# EAGLE design smartStarter (EAGLE 9.3.0)
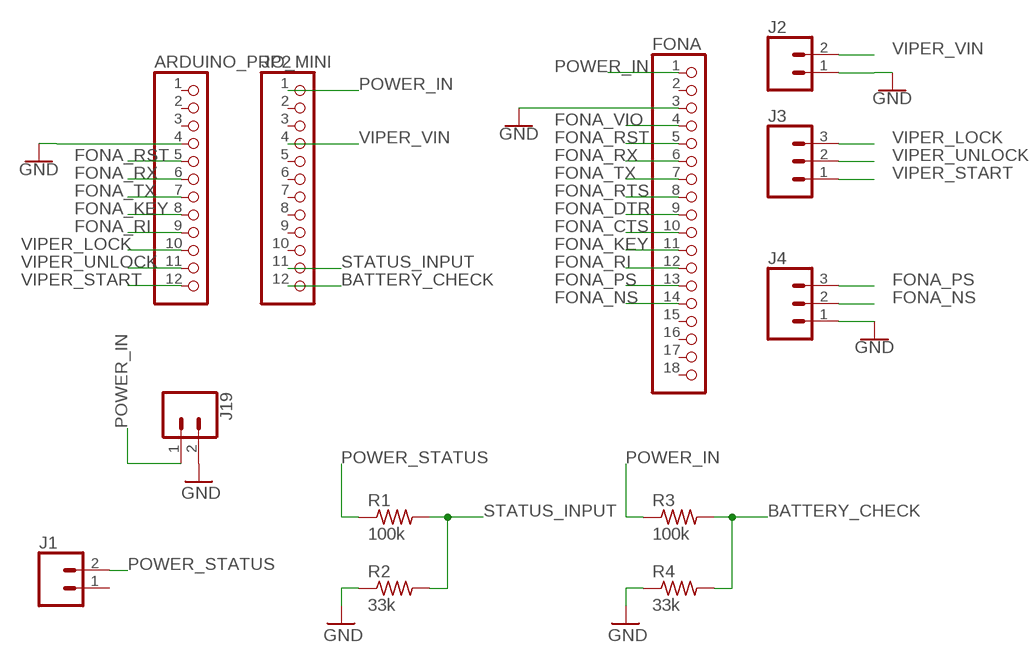
[diagram p0: schematic, sheet 1]

## Parts
ARDUINO_PRO_MINI  PINHD-1X12  [1X12]
FONA  PINHD-1X18  [1X18]
J1  CONN_023.5MM  [SCREWTERMINAL-3.5MM-2]
J2  CONN_023.5MM  [SCREWTERMINAL-3.5MM-2]
J3  CONN_03SCREW  [SCREWTERMINAL-3.5MM-3]
J4  CONN_03SCREW  [SCREWTERMINAL-3.5MM-3]
J19  CONN_023.5MM  [SCREWTERMINAL-3.5MM-2]
JP2  PINHD-1X12  [1X12]
R1  100k  R-US_0204/7  [0204/7]
R2  33k  R-US_0204/7  [0204/7]
R3  100k  R-US_0204/7  [0204/7]
R4  33k  R-US_0204/7  [0204/7]

## Nets
BATTERY_CHECK: JP2.12 R3.2 R4.2
FONA_CTS: FONA.10
FONA_DTR: FONA.9
FONA_KEY: ARDUINO_PRO_MINI.8 FONA.11
FONA_NS: FONA.14 J4.2
FONA_PS: FONA.13 J4.3
FONA_RI: ARDUINO_PRO_MINI.9 FONA.12
FONA_RST: ARDUINO_PRO_MINI.5 FONA.5
FONA_RTS: FONA.8
FONA_RX: ARDUINO_PRO_MINI.6 FONA.6
FONA_TX: ARDUINO_PRO_MINI.7 FONA.7
FONA_VIO: FONA.4
GND: ARDUINO_PRO_MINI.4 FONA.3 J2.1 J4.1 J19.2 R2.1 R4.1
POWER_IN: FONA.1 J19.1 JP2.1 R3.1
POWER_STATUS: J1.2 R1.1
STATUS_INPUT: JP2.11 R1.2 R2.2
VIPER_LOCK: ARDUINO_PRO_MINI.10 J3.3
VIPER_START: ARDUINO_PRO_MINI.12 J3.1
VIPER_UNLOCK: ARDUINO_PRO_MINI.11 J3.2
VIPER_VIN: J2.2 JP2.4
Unconnected: ARDUINO_PRO_MINI.1 ARDUINO_PRO_MINI.2 ARDUINO_PRO_MINI.3 FONA.2 FONA.15 FONA.16 FONA.17 FONA.18 J1.1 JP2.2 JP2.3 JP2.5 JP2.6 JP2.7 JP2.8 JP2.9 JP2.10

## Library data of the parts
ARDUINO_PRO_MINI JP2 = adafruit:PINHD-1X12: PIN HEADER
FONA = adafruit:PINHD-1X18: PIN HEADER
J1 J2 J19 = SparkFun-Connectors:CONN_02: Multi connection point. Often used as Generic Header-pin footprint for 0.1 inch spaced/style header connections On any of the 0.1 inch spaced packages, you can populate with these: Break Away Headers - Straight <https://www.sparkfun.com/products/116> (PRT-00116) Break Away Male Headers - Right Angle <https://www.sparkfun.com/products/553> (PRT-00553) Female Headers <https://www.sparkfun.com/products/115> (PRT-00115) Break Away Headers - Machine Pin <https://www.sparkfun.com/products/117> (PRT-00117) Break Away Female Headers - Swiss Machine Pin <https://www.sparkfun.com/products/743> (PRT-00743) For SCREWTERMINALS and SPRING TERMINALS visit here: Screw Terimnals on SparkFun.com <https://www.sparkfun.com/search/results?term=Screw+Terminals> (5mm/3.5mm/2.54mm spacing) This device is also useful as a general connection point to wire up your design to another part of your project. Our various solder wires solder well into these plated through hole pads. Hook-Up Wire - Assortment (Stranded, 22 AWG) <https://www.sparkfun.com/products/11375> (PRT-11375) Hook-Up Wire - Assortment (Solid Core, 22 AWG) <https://www.sparkfun.com/products/11367> (PRT-11367) View the entire wire category on our website here <https://www.sparkfun.com/categories/141> Special notes: Molex polarized connector foot print use with: PRT-08233 with associated crimp pins and housings. 2.54_SCREWTERM for use with PRT-10571. 3.5mm Screw Terminal footprints for PRT-08084 5mm Screw Terminal footprints for use with PRT-08432; PROD_ID: CONN-08399
J3 J4 = SparkFun-Connectors:CONN_03: Multi connection point. Often used as Generic Header-pin footprint for 0.1 inch spaced/style header connections On any of the 0.1 inch spaced packages, you can populate with these: Break Away Headers - Straight <https://www.sparkfun.com/products/116> (PRT-00116) Break Away Male Headers - Right Angle <https://www.sparkfun.com/products/553> (PRT-00553) Female Headers <https://www.sparkfun.com/products/115> (PRT-00115) Break Away Headers - Machine Pin <https://www.sparkfun.com/products/117> (PRT-00117) Break Away Female Headers - Swiss Machine Pin <https://www.sparkfun.com/products/743> (PRT-00743) Stackable Header - 3 Pin (Female, 0.1") <https://www.sparkfun.com/products/13875> (PRT-13875) For SCREWTERMINALS and SPRING TERMINALS visit here: Screw Terimnals on SparkFun.com <https://www.sparkfun.com/search/results?term=Screw+Terminals> (5mm/3.5mm/2.54mm spacing) This device is also useful as a general connection point to wire up your design to another part of your project. Our various solder wires solder well into these plated through hole pads. Hook-Up Wire - Assortment (Stranded, 22 AWG) <https://www.sparkfun.com/products/11375> (PRT-11375) Hook-Up Wire - Assortment (Solid Core, 22 AWG) <https://www.sparkfun.com/products/11367> (PRT-11367) View the entire wire category on our website here <https://www.sparkfun.com/categories/141> Special notes: Molex polarized connector foot print use with SKU : PRT-08232 with associated crimp pins and housings.; PROD_ID: CONN-08288; SF_ID: PRT-08235
R1-R4 = rcl:R-US_: RESISTOR, American symbol; SPICEPREFIX: R

## Net classes
0 default: clearance 0.205 mm

## Board
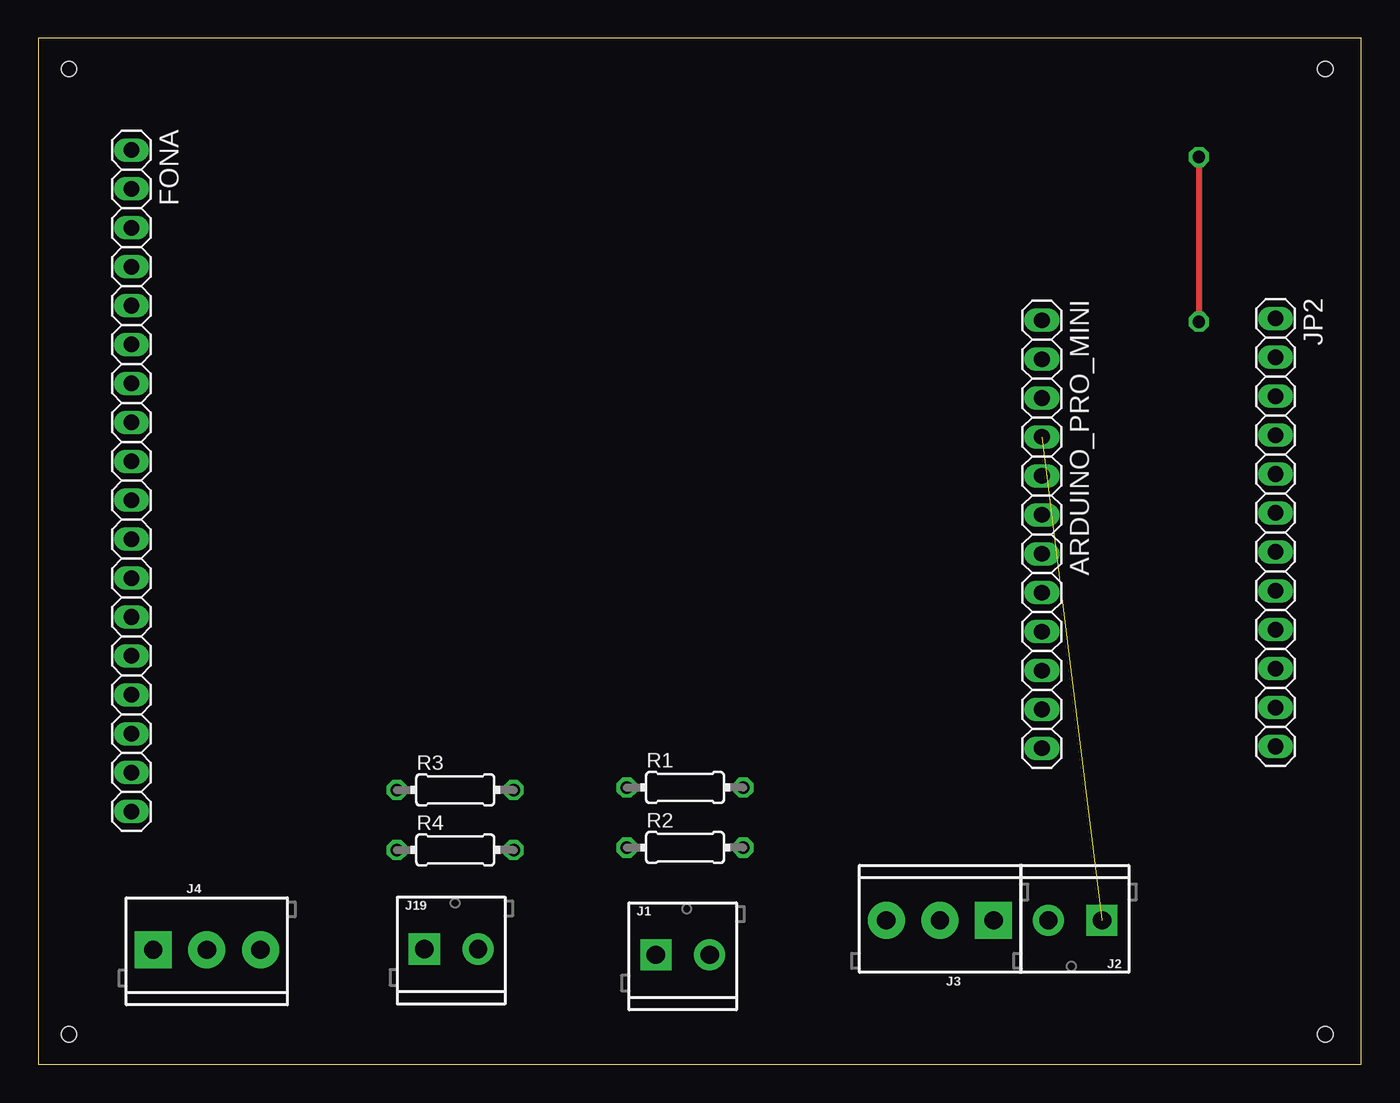
[diagram p1: board, top side]
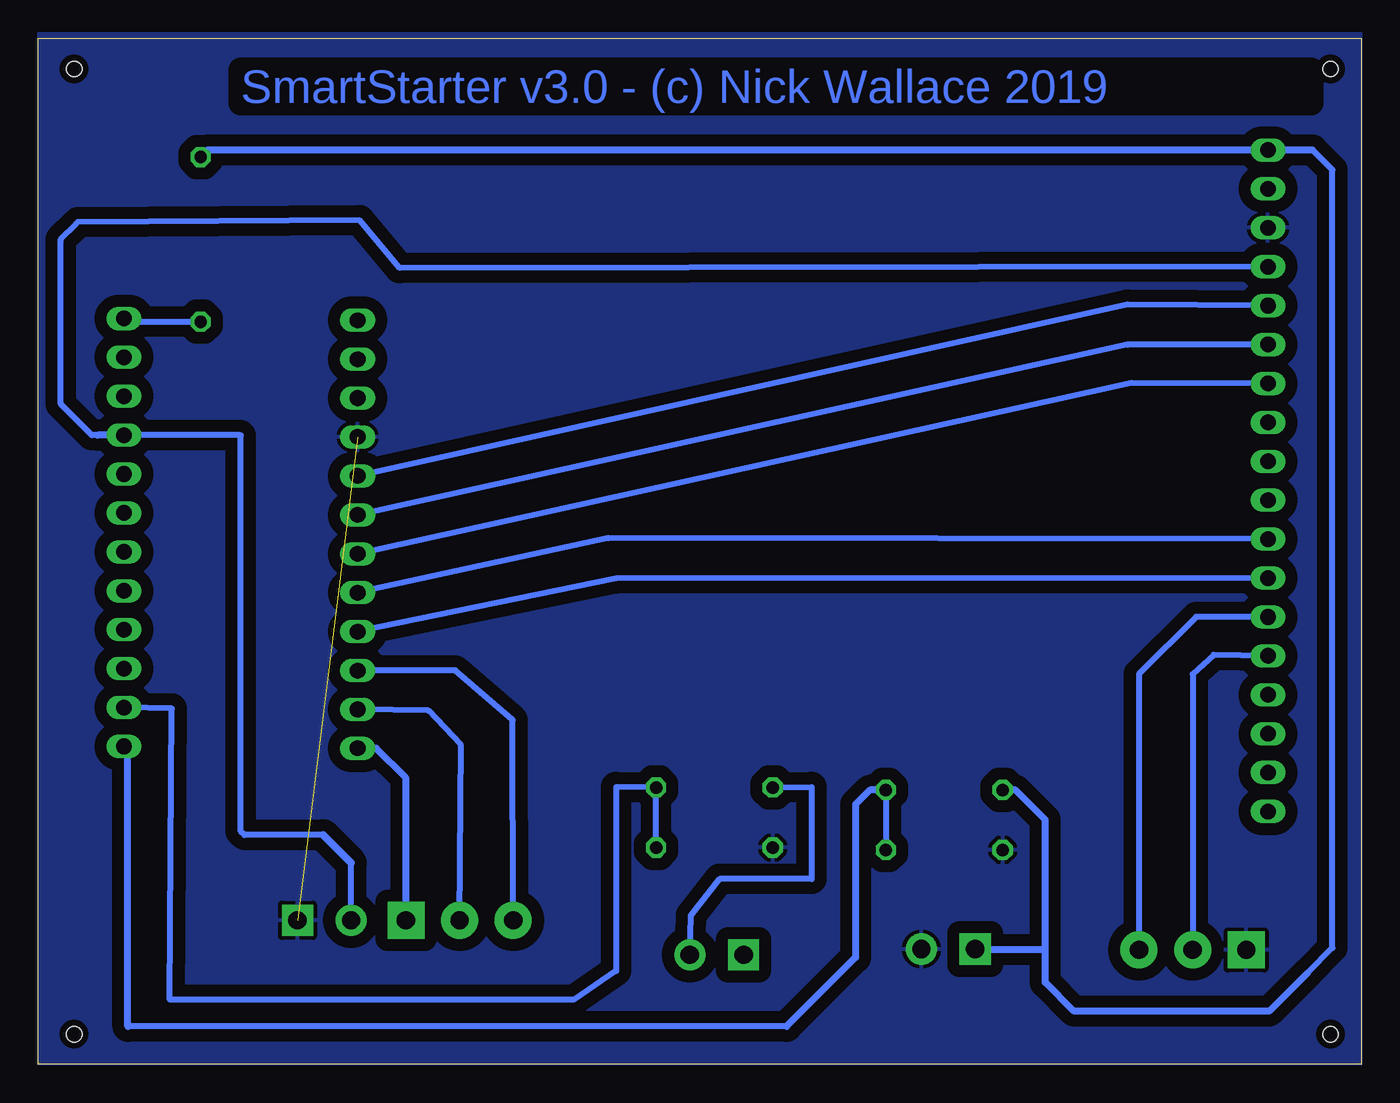
[diagram p2: board, bottom side, seen from below]

Size 86.34 x 66.98 mm. Coordinates in mm from the lower left corner, seen from the top.
Outline: 0,0 86.34,0 86.34,66.98 0,66.98 0,0
Copper layers (1*16): Top 0.035mm / dielectric 1.5mm / Bottom 0.035mm
Design rules "OthermillDRC_1_32_v2": minimum track width 8mil, minimum drill 0.8mm, track to track 0.794003125mm, track to pad 0.794003125mm, pad to pad 0.794003125mm, via to via 0.794003125mm, smd to smd 0mil, copper to edge 0mil, drill to drill 1mil, minimum pad ring 10mil, minimum via ring 10mil, stop-mask expansion 1mil, vias tented up to drill 30mil, thermal gap 10mil
Holes 1 mm at 84,64.98 84,1.98 2,1.98 2,64.98

### Footprints (pad centres in the part's own frame; a part is rotated, then mirrored left to right if it is on the bottom)
1X12 = drill 1.016 long: 1 -13.97,0; 2 -11.43,0; 3 -8.89,0; 4 -6.35,0; 5 -3.81,0; 6 -1.27,0; 7 1.27,0; 8 3.81,0; 9 6.35,0; 10 8.89,0; 11 11.43,0; 12 13.97,0
1X18 = drill 1.016 long: 1 -21.59,0; 2 -19.05,0; 3 -16.51,0; 4 -13.97,0; 5 -11.43,0; 6 -8.89,0; 7 -6.35,0; 8 -3.81,0; 9 -1.27,0; 10 1.27,0; 11 3.81,0; 12 6.35,0; 13 8.89,0; 14 11.43,0; 15 13.97,0; 16 16.51,0; 17 19.05,0; 18 21.59,0
SCREWTERMINAL-3.5MM-2 = drill 1.2 pad 2.032 square: 1 0,0 | drill 1.2 pad 2.032: 2 3.5,0
SCREWTERMINAL-3.5MM-3 = drill 1.2 pad 2.413 square: 1 0,0 | drill 1.2 pad 2.413: 2 3.5,0; 3 7,0
0204/7 = drill 0.813 octagon: 1 -3.81,0; 2 3.81,0

### Placement (x,y rotation side)
ARDUINO_PRO_MINI  65.5,34.6 270 top
FONA  6.08,38.1 270 top
J1  40.31,7.16 0 top
J2  69.42,9.41 180 top
J3  62.34,9.41 180 top
J4  7.5,7.48 0 top
J19  25.2,7.53 0 top
JP2  80.75,34.73 270 top
R1  42.21,18.08 0 top
R2  42.21,14.16 0 top
R3  27.21,17.92 0 top
R4  27.21,14 0 top

### Tracks (layer width: path | path; a pad name or v marks a point on that pad's centre or on a via)
BATTERY_CHECK
  Bottom 0.4: R3.2 R4.2
  Bottom 0.406: 37.5,2.48 80.5,2.48
  Bottom 0.45: R3.2 32.06,17.92 33,16.98 33,6.98 37.5,2.48 | 80.5,2.48 80.5,20.51 JP2.12
FONA_KEY
  Bottom 0.4: FONA.11 49.12,34.35 ARDUINO_PRO_MINI.8
FONA_NS
  Bottom 0.4: FONA.14 9.62,26.73 11,25.48 J4.2
FONA_PS
  Bottom 0.4: 14.5,25.48 J4.3
  Bottom 0.406: FONA.13 10.77,29.21 14.5,25.48
FONA_RI
  Bottom 0.4: FONA.12 48.62,31.73 ARDUINO_PRO_MINI.9
FONA_RST
  Bottom 0.4: FONA.5 15.25,49.6 ARDUINO_PRO_MINI.5
FONA_RX
  Bottom 0.4: FONA.6 15.25,46.98 ARDUINO_PRO_MINI.6
FONA_TX
  Bottom 0.4: FONA.7 15,44.48 ARDUINO_PRO_MINI.7
FONA_VIO
  Bottom 0.4: FONA.4 62.75,51.98 65.38,55.1 83.75,54.98
GND  (1 unrouted)
  pour Bottom (isolate 0.43): 0,67.31 86.36,67.31 86.36,0 0,0
POWER_IN  (via drill 0.8)
  Top 0.4: v75.75,59.23 v75.75,48.48
  Bottom 0.4: 5.58,59.69 FONA.1 | v75.75,48.48 80.53,48.48 JP2.1
  Bottom 0.406: 3.5,5.98 1.88,7.6 1.88,58.4 3.17,59.69
  Bottom 0.45: FONA.1 75.29,59.69 v75.75,59.23 | 3.5,5.98 6,3.48 18.75,3.48 20.62,5.35 20.62,7.48 | 3.17,59.69 5.58,59.69 | 20.62,7.48 20.62,15.98 22.57,17.92 R3.1 | J19.1 20.68,7.53 20.62,7.48
POWER_STATUS
  Bottom 0.4: R1.1 35.88,18.1 35.88,12.1 41.88,12.1 43.75,9.73 J1.2
STATUS_INPUT
  Bottom 0.4: R2.2 R1.2 48.62,18.1 48.62,6.1 51.38,4.23 77.75,4.23 77.62,23.23 JP2.11
VIPER_LOCK
  Bottom 0.4: J3.3 55.38,22.48 59.12,25.73 ARDUINO_PRO_MINI.10
VIPER_START
  Bottom 0.45: J3.1 62.34,18.7 62.38,18.73 64.28,20.63 ARDUINO_PRO_MINI.12
VIPER_UNLOCK
  Bottom 0.4: J3.2 58.75,20.85 60.88,23.1 ARDUINO_PRO_MINI.11
VIPER_VIN
  Bottom 0.4: J2.2 65.92,13.15 | JP2.4 73.15,41.08 73.12,41.05 73.12,15.23 72.88,14.98 67.75,14.98
  Bottom 0.406: 82.47,41.08 82.85,41.08 84.88,43.1 84.88,53.85 83.88,54.85
  Bottom 0.45: JP2.4 82.47,41.08
  Bottom 0.5: 65.92,13.15 67.75,14.98

### Text on the board
Bottom: SmartStarter v3.0 - (c) Nick Wallace 2019